# Altium schematic sheet main.SchDoc
size A3
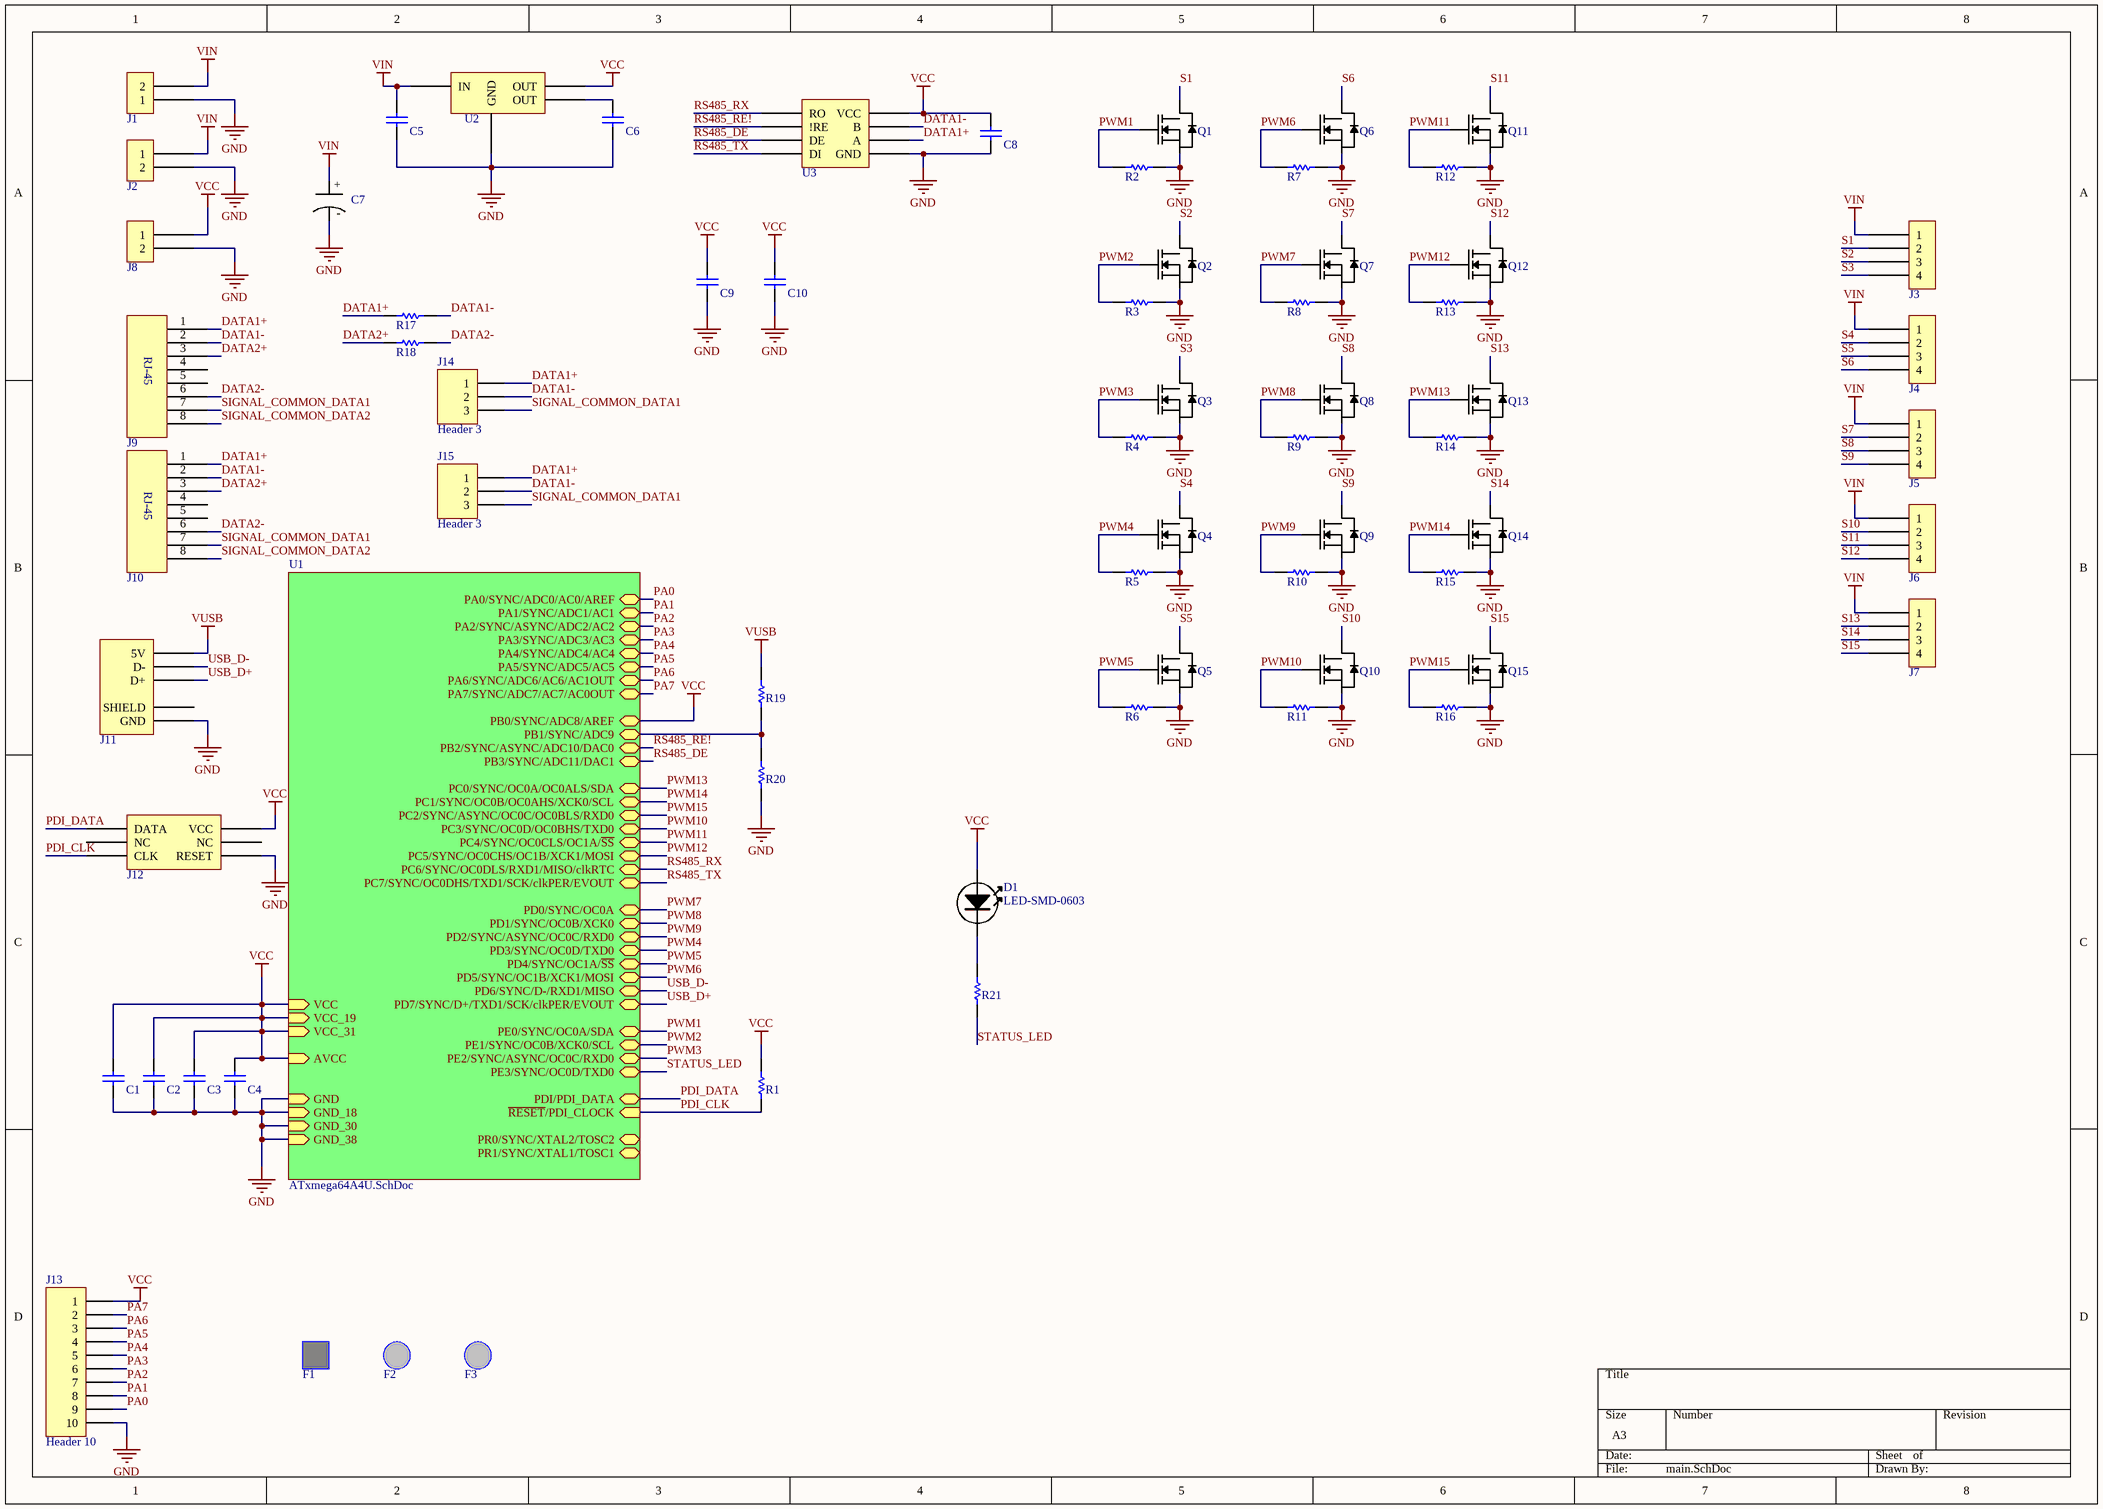
[diagram p0: main.SchDoc]

## Parts
C1  CAP 3.3nF 10V 0805(2012)  [CAPC0805(2012)145_M]  (value not drawn)
C2  CAP 3.3nF 10V 0805(2012)  [CAPC0805(2012)145_M]  (value not drawn)
C3  CAP 3.3nF 10V 0805(2012)  [CAPC0805(2012)145_M]  (value not drawn)
C4  CAP 3.3nF 10V 0805(2012)  [CAPC0805(2012)145_M]  (value not drawn)
C5  CAP 1uF 16V 1210(3225)  [CAPC1210(3225)155_N]  (value not drawn)
C6  CAP 10uF 6.3V 1210(3225)  [CAPC1210(3225)170_L]  (value not drawn)
C7  ELECTROLYTIC-CAP-220uF  [ELECTROLYTIC-220uF]  (value not drawn)
C8  CAP 3.3nF 10V 0805(2012)  [CAPC0805(2012)145_M]  (value not drawn)
C9  CAP 10uF 6.3V 1210(3225)  [CAPC1210(3225)170_L]  (value not drawn)
C10  CAP 10uF 6.3V 1210(3225)  [CAPC1210(3225)170_L]  (value not drawn)
D1  LED-SMD-0603  [LED-0603]
F1  Fiducial square  [FIDU-SQUARE]  (value not drawn)
F2  Fiducial round  [FIDU-ROUND]  (value not drawn)
F3  Fiducial round  [FIDU-ROUND]  (value not drawn)
J1  PLUGGABLE-TERMINAL-2  [PLUG_TERMINAL_2]  (value not drawn)
J2  PLUGGABLE-TERMINAL-2  [PLUG_TERMINAL_2]  (value not drawn)
J3  PLUGGABLE-TERMINAL-4  [PLUG_TERMINAL_4]  (value not drawn)
J4  PLUGGABLE-TERMINAL-4  [PLUG_TERMINAL_4]  (value not drawn)
J5  PLUGGABLE-TERMINAL-4  [PLUG_TERMINAL_4]  (value not drawn)
J6  PLUGGABLE-TERMINAL-4  [PLUG_TERMINAL_4]  (value not drawn)
J7  PLUGGABLE-TERMINAL-4  [PLUG_TERMINAL_4]  (value not drawn)
J8  PLUGGABLE-TERMINAL-2  [PLUG_TERMINAL_2]  (value not drawn)
J9  RJ-45 Connector  [RJ-45]  (value not drawn)
J10  RJ-45 Connector  [RJ-45]  (value not drawn)
J11  USB-MINI  [USB-mini]  (value not drawn)
J12  PDI  [HEADER_SMD_3x2_50MIL]  (value not drawn)
J13  Header 10  [HDR1X10]
J14  Header 3  [HDR1X3]
J15  Header 3  [HDR1X3]
Q1  TSM2314CX  [SOT95P280X130-3N]  (value not drawn)
Q2  TSM2314CX  [SOT95P280X130-3N]  (value not drawn)
Q3  TSM2314CX  [SOT95P280X130-3N]  (value not drawn)
Q4  TSM2314CX  [SOT95P280X130-3N]  (value not drawn)
Q5  TSM2314CX  [SOT95P280X130-3N]  (value not drawn)
Q6  TSM2314CX  [SOT95P280X130-3N]  (value not drawn)
Q7  TSM2314CX  [SOT95P280X130-3N]  (value not drawn)
Q8  TSM2314CX  [SOT95P280X130-3N]  (value not drawn)
Q9  TSM2314CX  [SOT95P280X130-3N]  (value not drawn)
Q10  TSM2314CX  [SOT95P280X130-3N]  (value not drawn)
Q11  TSM2314CX  [SOT95P280X130-3N]  (value not drawn)
Q12  TSM2314CX  [SOT95P280X130-3N]  (value not drawn)
Q13  TSM2314CX  [SOT95P280X130-3N]  (value not drawn)
Q14  TSM2314CX  [SOT95P280X130-3N]  (value not drawn)
Q15  TSM2314CX  [SOT95P280X130-3N]  (value not drawn)
R1  10K 1% 0805(2012)  [RESC0805(2012)_M]  (value not drawn)
R2  10K 1% 0805(2012)  [RESC0805(2012)_M]  (value not drawn)
R3  10K 1% 0805(2012)  [RESC0805(2012)_M]  (value not drawn)
R4  10K 1% 0805(2012)  [RESC0805(2012)_M]  (value not drawn)
R5  10K 1% 0805(2012)  [RESC0805(2012)_M]  (value not drawn)
R6  10K 1% 0805(2012)  [RESC0805(2012)_M]  (value not drawn)
R7  10K 1% 0805(2012)  [RESC0805(2012)_M]  (value not drawn)
R8  10K 1% 0805(2012)  [RESC0805(2012)_M]  (value not drawn)
R9  10K 1% 0805(2012)  [RESC0805(2012)_M]  (value not drawn)
R10  10K 1% 0805(2012)  [RESC0805(2012)_M]  (value not drawn)
R11  10K 1% 0805(2012)  [RESC0805(2012)_M]  (value not drawn)
R12  10K 1% 0805(2012)  [RESC0805(2012)_M]  (value not drawn)
R13  10K 1% 0805(2012)  [RESC0805(2012)_M]  (value not drawn)
R14  10K 1% 0805(2012)  [RESC0805(2012)_M]  (value not drawn)
R15  10K 1% 0805(2012)  [RESC0805(2012)_M]  (value not drawn)
R16  10K 1% 0805(2012)  [RESC0805(2012)_M]  (value not drawn)
R17  120R 1% 0805(2012)  [RESC0805(2012)_M]  (value not drawn)
R18  120R 1% 0805(2012)  [RESC0805(2012)_M]  (value not drawn)
R19  10K 1% 0805(2012)  [RESC0805(2012)_M]  (value not drawn)
R20  15K 1% 0805(2012)  [RESC0805(2012)_L]  (value not drawn)
R21  200R 1% 0805(2012)  [RESC0805(2012)_L]  (value not drawn)
U2  TLV1117  [SOT230P700X180-4N]  (value not drawn)
U3  MAX3485  [SOP127P600X175-8N]  (value not drawn)

## Sub-sheets
U1 = ATxmega64A4U.SchDoc: PR0/SYNC/XTAL2/TOSC2 (bidir), PR1/SYNC/XTAL1/TOSC1 (bidir), ~{RESET}/PDI_CLOCK (in), VCC, VCC_19, AVCC, GND, GND_18, GND_30, PA0/SYNC/ADC0/AC0/AREF (bidir), PA1/SYNC/ADC1/AC1 (bidir), PA2/SYNC/ASYNC/ADC2/AC2 (bidir), PA3/SYNC/ADC3/AC3 (bidir), PA4/SYNC/ADC4/AC4 (bidir), PA5/SYNC/ADC5/AC5 (bidir), PA6/SYNC/ADC6/AC6/AC1OUT (bidir), PA7/SYNC/ADC7/AC7/AC0OUT (bidir), PB0/SYNC/ADC8/AREF (bidir), PB1/SYNC/ADC9 (bidir), PB3/SYNC/ADC11/DAC1 (bidir), PC0/SYNC/OC0A/OC0ALS/SDA (bidir), PC1/SYNC/OC0B/OC0AHS/XCK0/SCL (bidir), PC2/SYNC/ASYNC/OC0C/OC0BLS/RXD0 (bidir), PC3/SYNC/OC0D/OC0BHS/TXD0 (bidir), PC4/SYNC/OC0CLS/OC1A/~{SS} (bidir), PC5/SYNC/OC0CHS/OC1B/XCK1/MOSI (bidir), PC6/SYNC/OC0DLS/RXD1/MISO/clkRTC (bidir), PC7/SYNC/OC0DHS/TXD1/SCK/clkPER/EVOUT (bidir), PD0/SYNC/OC0A (bidir), PD2/SYNC/ASYNC/OC0C/RXD0 (bidir), PD3/SYNC/OC0D/TXD0 (bidir), PD4/SYNC/OC1A/~{SS} (bidir), PD5/SYNC/OC1B/XCK1/MOSI (bidir), PD6/SYNC/D-/RXD1/MISO (bidir), PD7/SYNC/D+/TXD1/SCK/clkPER/EVOUT (bidir), PDI/PDI_DATA (bidir), PE0/SYNC/OC0A/SDA (bidir), PE1/SYNC/OC0B/XCK0/SCL (bidir), PE2/SYNC/ASYNC/OC0C/RXD0 (bidir), GND_38, PB2/SYNC/ASYNC/ADC10/DAC0 (bidir), PD1/SYNC/OC0B/XCK0 (bidir), PE3/SYNC/OC0D/TXD0 (bidir), VCC_31

## Nets
GND: C1.1 C2.1 C3.1 C4.1 C5.1 C6.1 C7.2(-) C8.1 C9.1 C10.1 J1.1 J2.2 J8.2 J11.5(GND) J12.6(RESET) J13.10 Q1.2(S) Q2.2(S) Q3.2(S) Q4.2(S) Q5.2(S) Q6.2(S) Q7.2(S) Q8.2(S) Q9.2(S) Q10.2(S) Q11.2(S) Q12.2(S) Q13.2(S) Q14.2(S) Q15.2(S) R2.2 R3.2 R4.2 R5.2 R6.2 R7.2 R8.2 R9.2 R10.2 R11.2 R12.2 R13.2 R14.2 R15.2 R16.2 R20.1 U2.1(GND) U3.5(GND) ; sheet U1/GND, sheet U1/GND_18, sheet U1/GND_30, sheet U1/GND_38
VCC: C1.2 C2.2 C3.2 C4.2 C8.2 C9.2 C10.2 D1.1 J8.1 J12.2(VCC) J13.1 R1.2 U2.4(OUT) U3.8(VCC) ; sheet U1/VCC, sheet U1/VCC_19, sheet U1/AVCC, sheet U1/PB0/SYNC/ADC8/AREF, sheet U1/VCC_31
VIN: C5.2 C7.1(+) J1.2 J2.1 J3.1 J4.1 J5.1 J6.1 J7.1 U2.3(IN)
VUSB: J11.1(5V) R19.2
DATA1+: J9.1 J10.1 J14.1 J15.1 R17.1 U3.6(A)
DATA1-: J9.2 J10.2 J14.2 J15.2 R17.2 U3.7(B)
DATA2+: J9.3 J10.3 R18.1
DATA2-: J9.6 J10.6 R18.2
PA0: J13.9 ; sheet U1/PA0/SYNC/ADC0/AC0/AREF
PA1: J13.8 ; sheet U1/PA1/SYNC/ADC1/AC1
PA2: J13.7 ; sheet U1/PA2/SYNC/ASYNC/ADC2/AC2
PA3: J13.6 ; sheet U1/PA3/SYNC/ADC3/AC3
PA4: J13.5 ; sheet U1/PA4/SYNC/ADC4/AC4
PA5: J13.4 ; sheet U1/PA5/SYNC/ADC5/AC5
PA6: J13.3 ; sheet U1/PA6/SYNC/ADC6/AC6/AC1OUT
PA7: J13.2 ; sheet U1/PA7/SYNC/ADC7/AC7/AC0OUT
PDI_CLK: J12.5(CLK) R1.1 ; sheet U1/~{RESET}/PDI_CLOCK
PDI_DATA: J12.1(DATA) ; sheet U1/PDI/PDI_DATA
PWM1: Q1.1(G) R2.1 ; sheet U1/PE0/SYNC/OC0A/SDA
PWM2: Q2.1(G) R3.1 ; sheet U1/PE1/SYNC/OC0B/XCK0/SCL
PWM3: Q3.1(G) R4.1 ; sheet U1/PE2/SYNC/ASYNC/OC0C/RXD0
PWM4: Q4.1(G) R5.1 ; sheet U1/PD3/SYNC/OC0D/TXD0
PWM5: Q5.1(G) R6.1 ; sheet U1/PD4/SYNC/OC1A/~{SS}
PWM6: Q6.1(G) R7.1 ; sheet U1/PD5/SYNC/OC1B/XCK1/MOSI
PWM7: Q7.1(G) R8.1 ; sheet U1/PD0/SYNC/OC0A
PWM8: Q8.1(G) R9.1 ; sheet U1/PD1/SYNC/OC0B/XCK0
PWM9: Q9.1(G) R10.1 ; sheet U1/PD2/SYNC/ASYNC/OC0C/RXD0
PWM10: Q10.1(G) R11.1 ; sheet U1/PC3/SYNC/OC0D/OC0BHS/TXD0
PWM11: Q11.1(G) R12.1 ; sheet U1/PC4/SYNC/OC0CLS/OC1A/~{SS}
PWM12: Q12.1(G) R13.1 ; sheet U1/PC5/SYNC/OC0CHS/OC1B/XCK1/MOSI
PWM13: Q13.1(G) R14.1 ; sheet U1/PC0/SYNC/OC0A/OC0ALS/SDA
PWM14: Q14.1(G) R15.1 ; sheet U1/PC1/SYNC/OC0B/OC0AHS/XCK0/SCL
PWM15: Q15.1(G) R16.1 ; sheet U1/PC2/SYNC/ASYNC/OC0C/OC0BLS/RXD0
RS485_DE: U3.3(DE) ; sheet U1/PB3/SYNC/ADC11/DAC1
RS485_RE!: U3.2(!RE) ; sheet U1/PB2/SYNC/ASYNC/ADC10/DAC0
RS485_RX: U3.1(RO) ; sheet U1/PC6/SYNC/OC0DLS/RXD1/MISO/clkRTC
RS485_TX: U3.4(DI) ; sheet U1/PC7/SYNC/OC0DHS/TXD1/SCK/clkPER/EVOUT
S1: J3.2 Q1.3(D)
S2: J3.3 Q2.3(D)
S3: J3.4 Q3.3(D)
S4: J4.2 Q4.3(D)
S5: J4.3 Q5.3(D)
S6: J4.4 Q6.3(D)
S7: J5.2 Q7.3(D)
S8: J5.3 Q8.3(D)
S9: J5.4 Q9.3(D)
S10: J6.2 Q10.3(D)
S11: J6.3 Q11.3(D)
S12: J6.4 Q12.3(D)
S13: J7.2 Q13.3(D)
S14: J7.3 Q14.3(D)
S15: J7.4 Q15.3(D)
SIGNAL_COMMON_DATA1: J9.7 J10.7 J14.3 J15.3
SIGNAL_COMMON_DATA2: J9.8 J10.8
STATUS_LED: R21.1 ; sheet U1/PE3/SYNC/OC0D/TXD0
USB_D+: J11.3(D+) ; sheet U1/PD7/SYNC/D+/TXD1/SCK/clkPER/EVOUT
USB_D-: J11.2(D-) ; sheet U1/PD6/SYNC/D-/RXD1/MISO
NetC6_2: C6.2 U2.2(OUT)
NetD1_2: D1.2 R21.2
NetR19_1: R19.1 R20.2 ; sheet U1/PB1/SYNC/ADC9

Not connected (* = marked no-connect by the designer): J9 4 5; J10 4 5; J11 0(SHIELD); J12 3(NC) 4(NC)

## Library data of the parts
C1-C4 C8 = CMP-1036-03387-1: CAP 3.3nF 10V ±1% 0805 (2012 Metric) Thickness 1.45mm SMD; Case-Metric: 2012; Case-EIA: 0805; Rated Voltage: 10 V; Value: 3.3nF; Technology: SMT; Tolerance: ±1%; Max Thickness: 1.45 mm
C5 = CMP-1038-02008-1: CAP 1uF 16V ±5% 1210 (3225 Metric) Thickness 1.45mm SMD; Case-Metric: 3225; Case-EIA: 1210; Max Thickness: 1.45 mm; Technology: SMT; Rated Voltage: 16 V; Value: 1uF; Tolerance: ±5%
C6 C9 C10 = CMP-1038-02188-1: CAP 10uF 6.3V ±10% 1210 (3225 Metric) Thickness 1.7mm SMD; Case-EIA: 1210; Case-Metric: 3225; Technology: SMT; Tolerance: ±10%; Rated Voltage: 6.3 V; Value: 10uF; Max Thickness: 1.7 mm
D1 = CMP-00004-A.1: SMD Led 0603
F1 = FIDUCIAL_SQUARE
F2 F3 = FIDUCIAL_ROUND
J9 J10 = CMP-00009-A.1: RJ-45 Ethernet Connector; Tolerance: 1; Temp. Coefficent: ±100; Technology: SMT
J11 = CMP-00000-A.2: USB-Mini Connector; Tolerance: 1; Temp. Coefficent: ±100; Technology: SMT
J13 = Header 10: Header, 10-Pin; LatestRevisionDate: 17-Jul-2002; LatestRevisionNote: Re-released for DXP Platform.; Publisher: Altium Limited
J14 J15 = Header 3: Header, 3-Pin; LatestRevisionDate: 17-Jul-2002; LatestRevisionNote: Re-released for DXP Platform.; Publisher: Altium Limited
Q1-Q15 = TSM2314CX: MOSFET 4.9A max switching load
R1-R16 R19 = CMP-1013-00623-1: 10K 0.125W 1% 0805 (2012 Metric)  SMD; Value: 10000.00 Ohm; Case-Metric: 2012; Case-EIA: 0805; Tolerance: 1 %; Power: 0.125 W; Technology: SMT
R17 R18 = CMP-1013-00405-1: 120R 0.125W 1% 0805 (2012 Metric)  SMD; Case-Metric: 2012; Case-EIA: 0805; Value: 120.00 Ohm; Tolerance: 1 %; Technology: SMT; Power: 0.125 W
R20 = CMP-1013-00641-1: 15K 0.125W 1% 0805 (2012 Metric)  SMD; Case-Metric: 2012; Case-EIA: 0805; Value: 15000.00 Ohm; Power: 0.125 W; Tolerance: 1 %; Technology: SMT
R21 = CMP-1013-00429-1: 200R 0.125W 1% 0805 (2012 Metric)  SMD; Case-EIA: 0805; Case-Metric: 2012; Value: 200.00 Ohm; Technology: SMT; Power: 0.125 W; Tolerance: 1 %
U2 = CMP-00003-A.1: 3.3V Linear Regulator